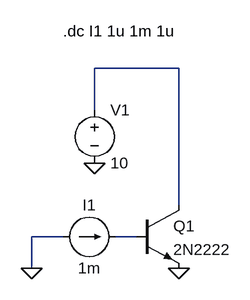
[diagram p0: schematic 4.1.asc]
4.1.asc, the LTspice schematic file:
Version 4.1
SHEET 1 880 680
WIRE 384 -176 256 -176
WIRE 256 -112 256 -176
WIRE 384 32 384 -176
WIRE 208 80 160 80
WIRE 320 80 288 80
WIRE 160 128 160 80
FLAG 384 128 0
FLAG 160 128 0
FLAG 256 -32 0
SYMBOL npn 320 32 R0
SYMATTR InstName Q1
SYMATTR Value 2N2222
SYMBOL voltage 256 -128 R0
WINDOW 123 0 0 Left 0
WINDOW 39 0 0 Left 0
SYMATTR InstName V1
SYMATTR Value 10
SYMBOL current 208 80 R270
WINDOW 0 32 40 VTop 2
WINDOW 3 -32 40 VBottom 2
WINDOW 123 0 0 Left 0
WINDOW 39 0 0 Left 0
SYMATTR InstName I1
SYMATTR Value 1m
TEXT 208 -232 Left 2 !.dc I1 1u 1m 1u

The netlist it stands for:
* 4.1.asc
Q1 N001 N002 0 0 2N2222
V1 N001 0 10
I1 0 N002 1m
.model NPN NPN
.model PNP PNP
.lib standard.bjt
.dc I1 1u 1m 1u
.backanno
.end